# Altium schematic sheet 358漫&镜面反射20260718.SchDoc
size 500 x 400 mm; SheetNumber: 1; SheetTotal: 1
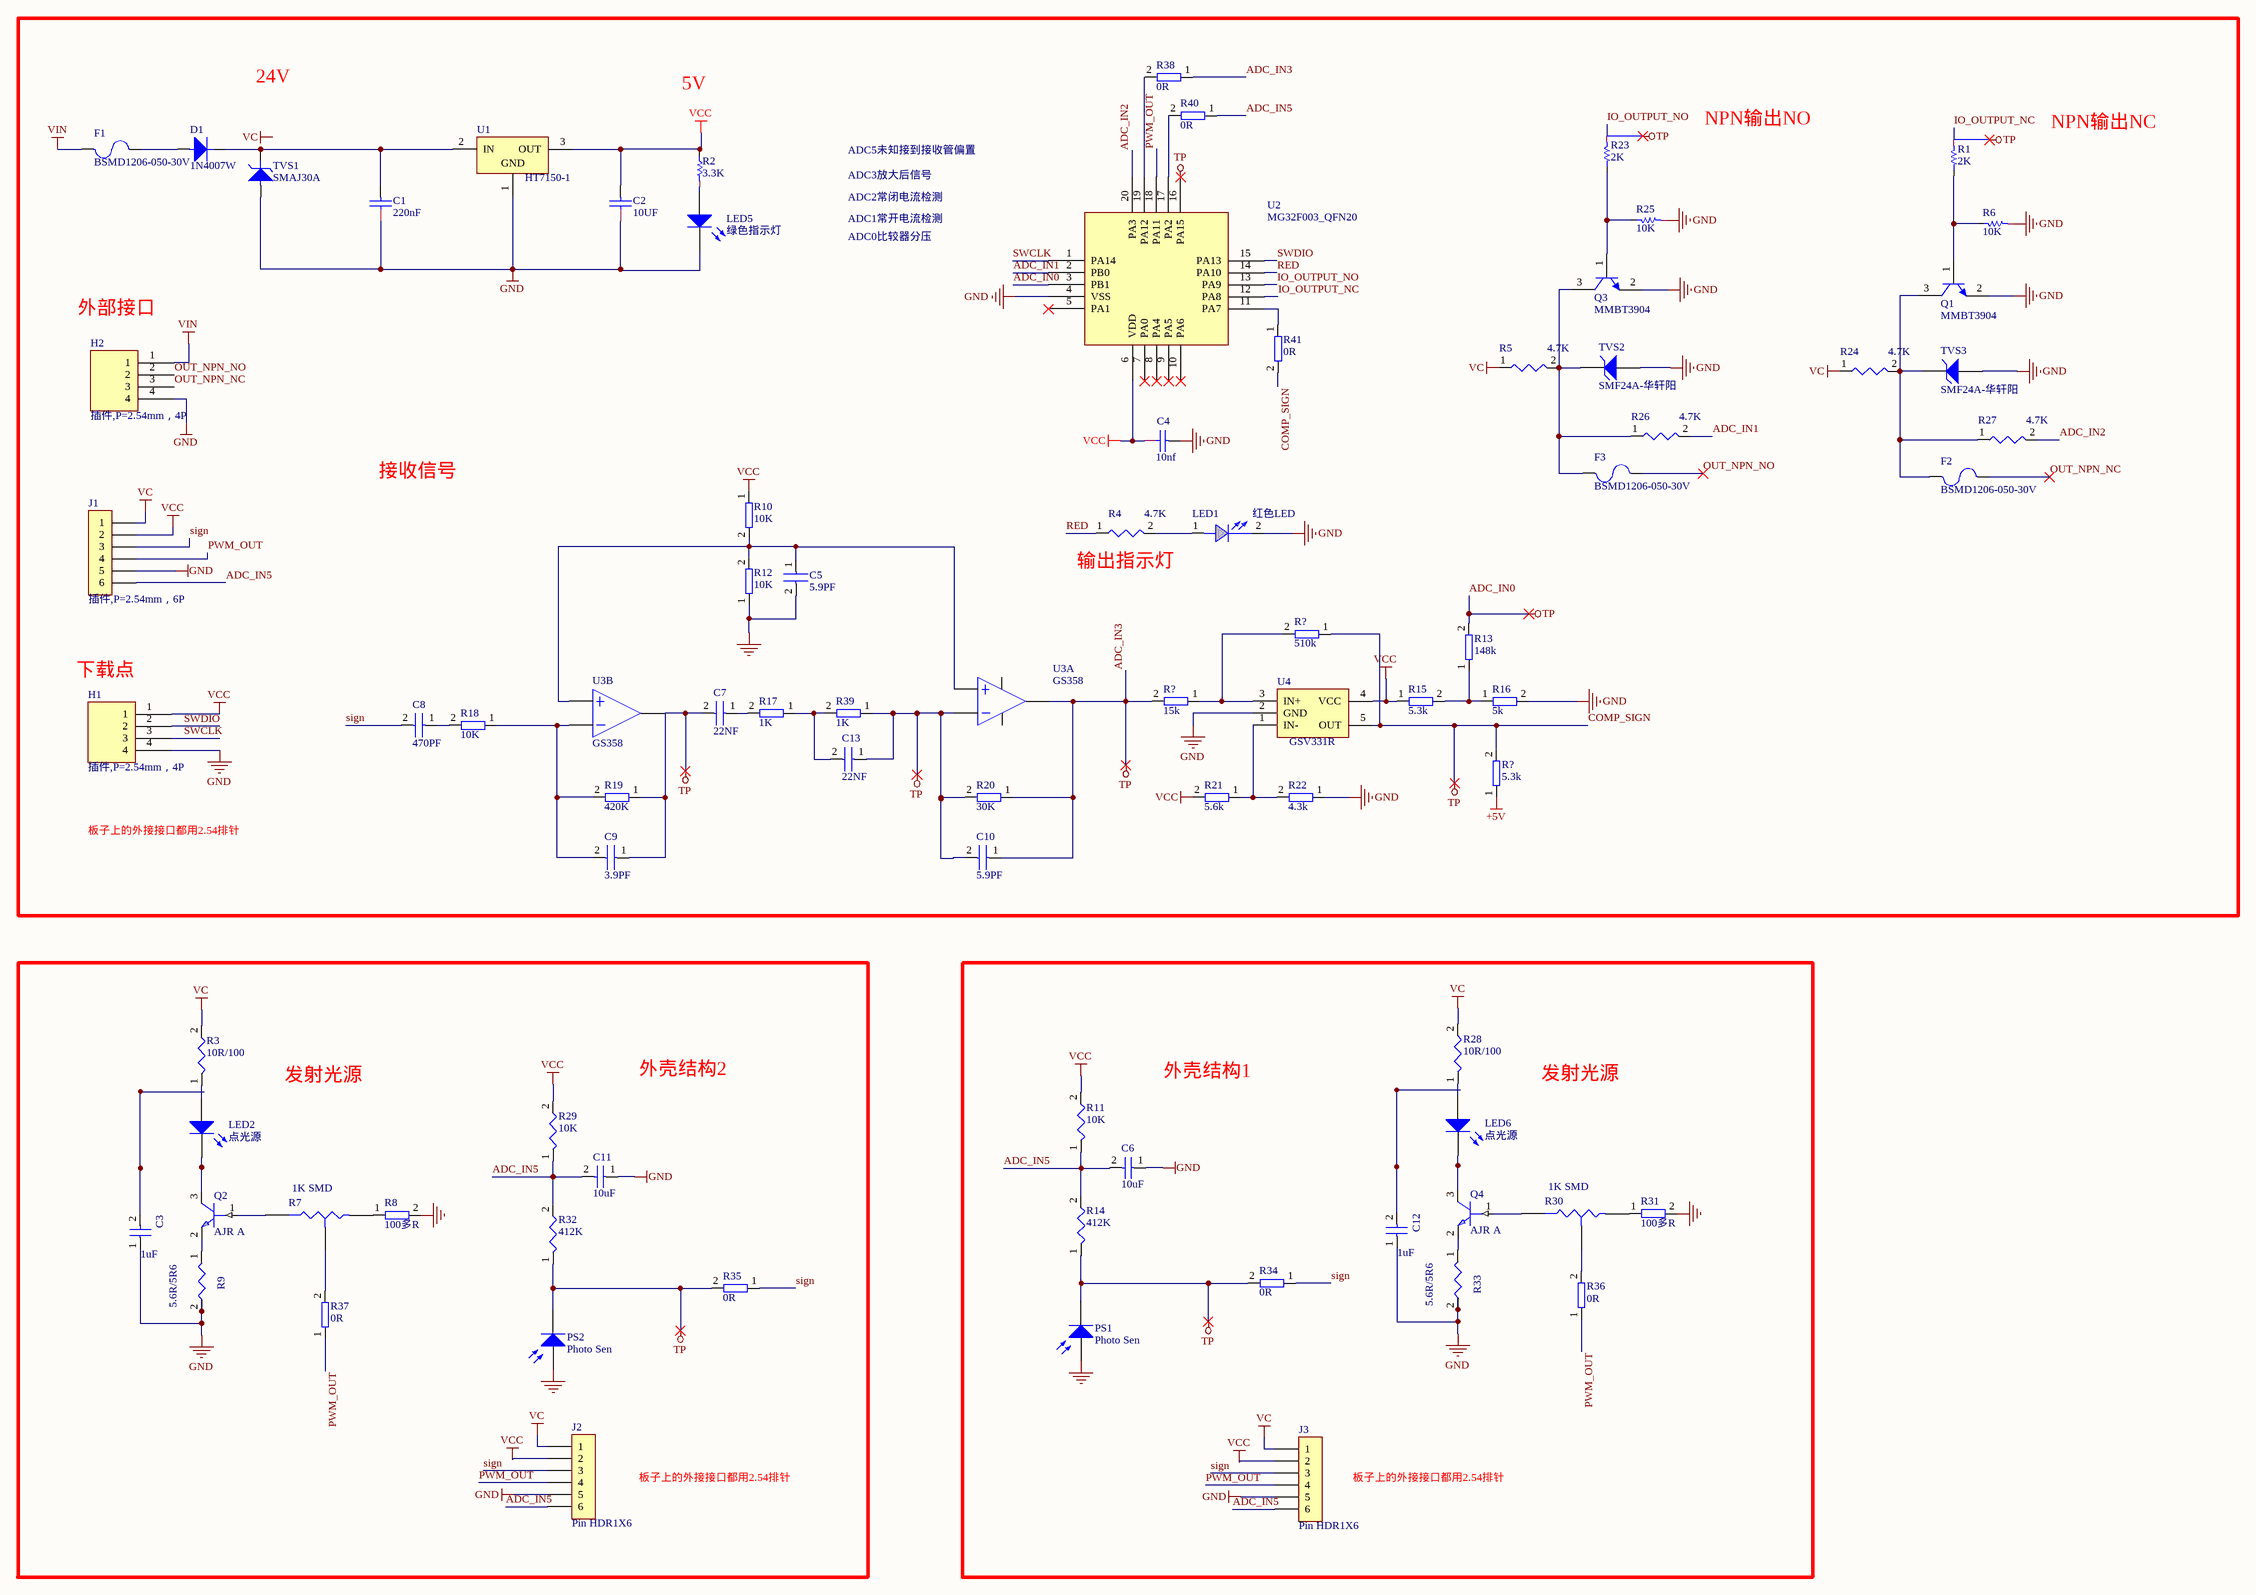
[diagram p0: 358漫&镜面反射20260718.SchDoc]

## Parts
(Parts that share a designator on the sheet are numbered #1, #2 ... from top to bottom, then left to right.)
C1  220nF  [0603A]
C2  10UF  [0603A]
C3  1uF  [1206]
C4  10nf  [0603A]
C5  5.9PF
C6  10uF  [0603]
C7  22NF
C8  470PF
C9  3.9PF
C10  5.9PF
C11  10uF  [0603]
C12  1uF  [1206]
C13  22NF
D1  1N4007W  [D1]
F1  BSMD1206-050-30V  [1206]
F2  BSMD1206-050-30V  [1206]
F3  BSMD1206-050-30V  [1206]
H1  插件,P=2.54mm，4P  [Pin HDR1X4/2.54mm-S]
H2  插件,P=2.54mm，4P  [Pin HDR1X4/2.54mm-S]
J1  插件,P=2.54mm，6P  [Pin HDR1X6/2.54mm-S]
J2  Pin HDR1X6  [Pin HDR1X6/2.54mm-S]
J3  Pin HDR1X6  [Pin HDR1X6/2.54mm-S]
LED1  红色LED  [0603V]
LED2  点光源  [LED-0]
LED5  绿色指示灯  [3.2X1.6X1.1]
LED6  点光源  [LED-0]
PS1  Photo Sen  [PIN2]
PS2  Photo Sen  [PIN2]
Q1  MMBT3904  [TO-226-AA]
Q2  AJR A  [SOT-23]
Q3  MMBT3904  [TO-226-AA]
Q4  AJR A  [SOT-23]
R1  2K  [0603]
R2  3.3K  [0603]
R3  10R/100  [0603]
R4  4.7K  [0402]
R5  4.7K  [0402]
R6  10K  [0603]
R7  value 1K SMD  [VR3]  (hidden comment: Res Tap)
R8  100多R
R9  5.6R/5R6  [0603V]
R10  10K
R11  10K  [0402]
R12  10K
R13  148k
R14  412K  [0402]
R15  5.3k
R16  5k
R17  1K
R18  10K
R19  420K
R20  30K
R21  5.6k
R22  4.3k
R23  2K  [0603]
R24  4.7K  [0402]
R25  10K  [0603]
R26  4.7K  [0402]
R27  4.7K  [0402]
R28  10R/100  [0603]
R29  10K  [0402]
R30  value 1K SMD  [VR3]  (hidden comment: Res Tap)
R31  100多R
R32  412K  [0402]
R33  5.6R/5R6  [0603V]
R34  0R
R35  0R
R36  0R
R37  0R
R38  0R
R39  1K
R40  0R
R41  0R
R?#1  510k
R?#2  15k
R?#3  5.3k
TVS1  SMAJ30A  [D2]
TVS2  SMF24A-华轩阳  [GLZZ0002ZA-A]
TVS3  SMF24A-华轩阳  [GLZZ0002ZA-A]
U1  HT7150-1  [SOT89N]
U2  MG32F003_QFN20  [HT3.96-11P]
U3  GS358  [SOP-8]  (parts A,B of 2)
U4  GSV331R  [SC70]

## Nets
+5V: R?#3.1
ADC_IN0: C7.2 C9.1 C10.1 C10.2 C13.1 PS1.2(K) PS2.2(K) R13.2 R14.1 R19.1 R20.1 R20.2 R32.1 R34.2 R35.2 R38.1 R39.1 R41.2 R?#1.1 R?#2.2 R?#3.2 U2.3(PB1) U2.16(PA15) U3.1 U3.2 U3.7 U4.5(OUT)  [also labelled ADC_IN3, COMP_SIGN, TP]
GND: C1.2 C2.2 C3.1 C4.1 C5.2 C6.1 C11.1 C12.1 H1.4 H2.4 J1.5 J2.5 J3.5 LED1.2(CATHODE) LED5.2(K) PS1.1(A) PS2.1(A) Q1.2(E) Q3.2(E) R6.2 R8.2 R9.2 R12.1 R16.2 R22.1 R25.2 R31.2 R33.2 TVS1.1 TVS2.2(A) TVS3.2(A) U1.1(GND) U2.4(VSS) U4.2(GND)
VC: J1.1 J2.1 J3.1 R3.2 R5.1 R24.1 R28.2
VCC: C2.1 C4.2 H1.1 J1.2 J2.2 J3.2 R2.1 R10.1 R11.2 R15.1 R21.2 R29.2 U1.3(OUT) U2.6(VDD) U4.4(VCC)
VIN: F1.2 H2.1
ADC_IN1: R26.2 U2.2(PB0)
ADC_IN2: R27.2 U2.20(PA3)
ADC_IN5: C6.2 C11.2 J1.6 J2.6 J3.6 R11.1 R14.2 R29.1 R32.2 R40.1
IO_OUTPUT_NC: R1.2 U2.12(PA8)
IO_OUTPUT_NO: R23.2 U2.13(PA9)
OUT_NPN_NC: F2.2 H2.3
OUT_NPN_NO: F3.2 H2.2
PWM_OUT: J1.4 J2.4 J3.4 R36.1 R37.1 U2.18(PA11)
RED: R4.1 U2.14(PA10)
sign: C8.2 J1.3 J2.3 J3.3 R34.1 R35.1
SWCLK: H1.3 U2.1(PA14)
SWDIO: H1.2 U2.15(PA13)
NetC1_1: C1.1 D1.2(K) TVS1.2 U1.2(IN)
NetC5_1: C5.1 R10.2 R12.2 U3.3 U3.5
NetC7_1: C7.1 R17.2
NetC8_1: C8.1 R18.2
NetC9_2: C9.2 R18.1 R19.2 U3.6
NetC13_2: C13.2 R17.1 R39.2
NetD1_1: D1.1(A) F1.1
NetF2_1: F2.1 Q1.3(C) R24.2 R27.1 TVS3.1(K)
NetF3_1: F3.1 Q3.3(C) R5.2 R26.1 TVS2.1(K)
NetLED1_1: LED1.1(ANODE) R4.2
NetLED2_1: LED2.1(A) R3.1
NetLED2_2: LED2.2(K) Q2.3(COLLECTOR)
NetLED5_1: LED5.1(A) R2.2
NetLED6_1: LED6.1(A) R28.1
NetLED6_2: LED6.2(K) Q4.3(COLLECTOR)
NetQ1_1: Q1.1(B) R1.1 R6.1
NetQ2_1: Q2.1(BASE) R7.2(B)
NetQ2_2: Q2.2(EMITTER) R9.1
NetQ3_1: Q3.1(B) R23.1 R25.1
NetQ4_1: Q4.1(BASE) R30.2(B)
NetQ4_2: Q4.2(EMITTER) R33.1
NetR7_1: R7.1(A) R8.1
NetR7_3: R7.3(TAP) R37.2
NetR13_1: R13.1 R15.2 R16.1
NetR21_1: R21.1 R22.2 U4.1(IN-)
NetR30_1: R30.1(A) R31.1
NetR30_3: R30.3(TAP) R36.2
NetR38_2: R38.2 U2.19(PA12)
NetR40_2: R40.2 U2.17(PA2)
NetR41_1: R41.1 U2.11(PA7)
NetR?#1_2: R?#1.2 R?#2.1 U4.3(IN+)

Not connected (* = marked no-connect by the designer): C3 2; C12 2; U2 5(PA1)* 7(PA0)* 8(PA4)* 9(PA5)* 10(PA6)*; U3 4 8

## Notes on the sheet
- 24V
- 5V
- NPN输出NO
- NPN输出NC
- ADC2常闭电流检测
- ADC3放大后信号
- ADC5未知接到接收管偏置
- ADC0比较器分压
- ADC1常开电流检测
- 外部接口
- 接收信号
- (near R4) 输出指示灯
- (near H1) 下载点
- 板子上的外接接口都用2.54排针
- 发射光源
- 外壳结构2
- 外壳结构1
- Labels drawn without touching a wire or pin: TP, VC

## Library data of the parts
C1 C2 = CAP: Capacitor
C3 C6 C11 C12 = CAP NP: Text Field1: 20; Text Field2: 10
C4 = CAP: 陶瓷电容
C5 C7-C10 C13 = CAP
D1 = DIODE
F1-F3 = FUSE
H1 H2 = 4P接线端2mm间距
J1 = Pin HDR1X6
LED1 = LED: Text Field1: 40; Text Field2: 20
LED2 LED6 = LED0: Typical INFRARED GaAs LED; Published: 8-Jun-2000; LatestRevisionDate: 08-Jul-2005; LatestRevisionNote: Mech Layer 1 removed.; PackageReference: LED-0; Publisher: Altium Limited; PackageDescription: LED; 2 Leads
LED5 = LED2: Typical RED, GREEN, YELLOW, AMBER GaAs LED; Published: 8-Jun-2000; LatestRevisionDate: 17-Jul-2002; LatestRevisionNote: Re-released for DXP Platform.; PackageVersion: Feb-2002; PackageReference: 3.2X1.6X1.1; Publisher: Altium Limited; PackageDescription: SM LED; 2 Flat Leads
PS1 PS2 = Photo Sen: Photosensitive Diode; Published: 24-Mar-1999; LatestRevisionDate: 17-Jul-2002; LatestRevisionNote: Re-released for DXP Platform.; PackageReference: PIN2; Publisher: Altium Limited
Q1 Q3 = NPN: NPN Bipolar Transistor; Published: 8-Jun-2000; LatestRevisionDate: 17-Jul-2002; LatestRevisionNote: Re-released for DXP Platform.; PackageReference: TO-226-AA; Publisher: Altium Limited; PackageDescription: TO, Flat Index; 3 In-Line, Axial Leads; Body Dia. 4.8mm; Leads 0.55 x 0.51 mm (max); Code_JEDEC: TO-226-AA
Q2 Q4 = Q2N2369_0: Text Field1: 20; Text Field2: 20
R1 R2 R6 R23 R25 = RAS
R3-R5 R9 R11 R14 R24 R26-R29 R32 R33 = R: Text Field1: 20; Text Field2: 30
R7 R30 = Res Tap: Tapped Resistor; Sim Note: Enter the Resistance value and the set point into parameter fields.; Set Position: 0.5; Published: 24-Mar-1999; LatestRevisionDate: 17-Jul-2002; LatestRevisionNote: Re-released for DXP Platform.; PackageReference: VR3; Publisher: Altium Limited; PackageDescription: Variable Resistor, Thru-Hole; 3 Leads
R8 R10 R12 R13 R15-R22 R31 R34-R41 R?#1-R?#3 = RES
TVS1 = DIODE V: Varactor Diode
TVS2 TVS3 = HZK20: Silicon Epitaxial Planar Zener Diodes for Stabilized Power Supply; Published: 12-Feb-2010; DatasheetVersion: Rev.3.00, May-2003; PackageVersion: Aug-2005; PackageReference: GLZZ0002ZA-A; Publisher: Altium Limited; PackageDescription: Metal Electrode Face (MELF) Diode; Body 3.5 x 1.35 mm (LxDia); ComponentLink1Description: Manufacturer Link; ComponentLink1URL: http://sg.renesas.com/fmwk.jsp?cnt=diode_landing.jsp&fp=/products/discrete/diodes/; ComponentLink2Description: Datasheet; ComponentLink2URL: http://documentation.renesas.com/eng/products/diode/rej03g0018_hzk.pdf; ComponentLink3Description: Packaging Specification; ComponentLink3URL: http://sg.renesas.com/media/products/common_info/package/pdf/diode/code/glzz0002za_a.pdf
U1 = HT7530-1: 3.0V 100mA Low Power,  Low Dropout Voltage (LDO) Regulator; Published: 30-Mar-2007; DatasheetVersion: rev1.50, Jan-2006; PackageVersion: Jan-2006; PackageReference: SOT-89; Publisher: Altium Limited; PackageDescription: 3-Pin SOT-89 Package 1.5 mm Pitch, 4.1 mm Lead Span; Code_IPC: SOT89; ComponentLink1Description: Manufacturer Link; ComponentLink1URL: http://www.holtek.com/; ComponentLink2Description: Datasheet; ComponentLink2URL: http://www.holtek.com/pdf/consumer/75xx_1v150.pdf
U2 = MG32F003-QFN20: QFN20主控芯片
U3 = LM358
U4 = C65